# EAGLE design WIK.pl_DC (EAGLE 6.5.0)
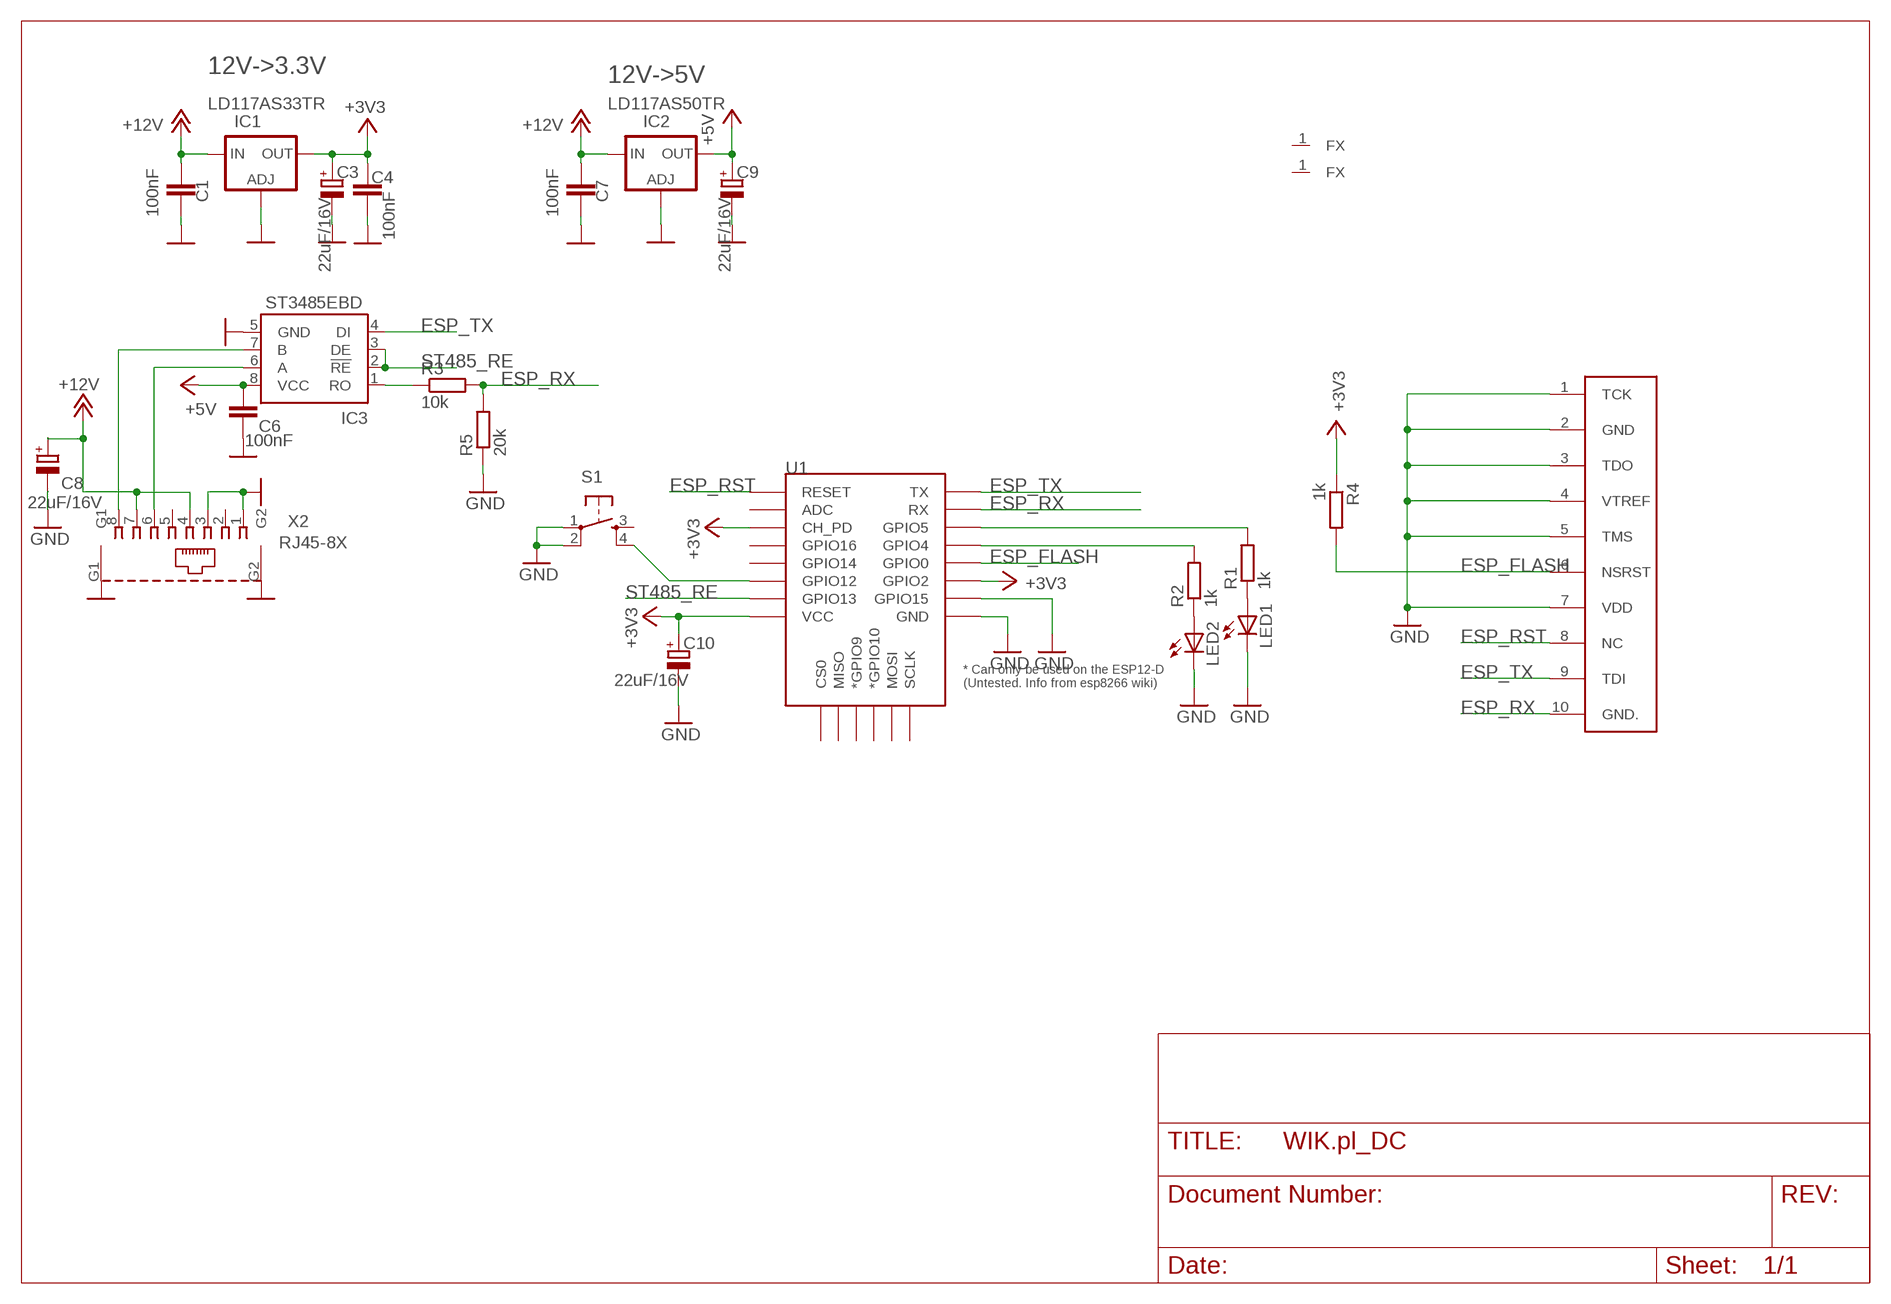
[diagram p0: schematic, sheet 1]

## Parts
C1  100nF  C-EUC0805  [C0805]
C3  22uF/16V  CPOL-EUSMCB  [SMC_B]
C4  100nF  C-EUC0805  [C0805]
C6  100nF  C-EUC0805  [C0805]
C7  100nF  C-EUC0805  [C0805]
C8  22uF/16V  CPOL-EUSMCB  [SMC_B]
C9  22uF/16V  CPOL-EUSMCB  [SMC_B]
C10  22uF/16V  CPOL-EUSMCB  [SMC_B]
IC1  LD117AS33TR  [SOT223]
IC2  LD117AS50TR  [SOT223]
IC3  ST3485EBD  LTC485S  [SOIC8]
LED1  LED1206  [LED-1206]
LED2  LED1206  [LED-1206]
R1  1k  R-EU_R0805  [R0805]
R2  1k  R-EU_R0805  [R0805]
R3  10k  R-EU_R0805  [R0805]
R4  1k  R-EU_R0805  [R0805]
R5  20k  R-EU_R0805  [R0805]
S1  TAC_SWITCHPTH  [TACTILE-PTH]
U1  ESP12ESMD  [ESP12E-SMD]
U$1  FIDUCIAL  [FIDUCIAL]
U$2  FIDUCIAL  [FIDUCIAL]
U$3  TC2050-IDC-NL  [TC2050-IDC-NL]
X2  RJ45-8X  [RJ45-NO-SHIELD]

## Nets
+3V3: C3.+ C4.1 C10.+ IC1.4(OUT) R4.1 U1.CH_PD U1.GPIO2 U1.VCC
+5V: C6.2 C9.+ IC2.4(OUT) IC3.8(VCC)
+12V: C1.1 C7.1 C8.+ IC1.3(IN) IC2.3(IN) X2.4 X2.7
ESP_FLASH: R4.2 U1.GPIO0 U$3.6(NSRST)
ESP_RST: U1.RESET U$3.8(NC)
ESP_RX: R3.2 R5.2 U1.RXD0(RX) U$3.10(GND.)
ESP_TX: IC3.4(DI) U1.TXD0(TX) U$3.9(TDI)
GND: C1.2 C3.- C4.2 C6.1 C7.2 C8.- C9.- C10.- IC1.1(ADJ) IC2.1(ADJ) IC3.5(GND) LED1.C LED2.C R5.1 S1.1 S1.2 U1.GND U1.GPIO15 U$3.1(TCK) U$3.2(GND) U$3.3(TDO) U$3.4(VTREF) U$3.5(TMS) U$3.7(VDD) X2.1 X2.3 X2.G1 X2.G2
N$1: IC3.7(B) X2.8
N$2: R1.2 U1.GPIO5
N$3: IC3.6(A) X2.6
N$4: LED1.A R1.1
N$5: LED2.A R2.1
N$6: R2.2 U1.GPIO4
N$7: S1.4 U1.GPIO12
N$8: IC3.1(RO) R3.1
ST485_RE: IC3.2(!RE) IC3.3(DE) U1.GPIO13
Unconnected: S1.3 U1.ADC U1.CS0 U1.GPIO9(*GPIO9) U1.GPIO10(*GPIO10) U1.GPIO14 U1.GPIO16 U1.MISO U1.MOSI U1.SCLK U$1.1(FX) U$2.1(FX) X2.2 X2.5

## Notes on the sheet
- 12V->3.3V
- 12V->5V

## Library data of the parts
C1 C4 C6 C7 = rcl:C-EU: CAPACITOR, European symbol
C3 C8-C10 = rcl:CPOL-EU: POLARIZED CAPACITOR, European symbol
IC1 IC2 = v-reg:LD117A?*: Low drop fixed and adjustable positive voltage regulators 1 A Source: http://www.st.com/stonline/products/literature/ds/7194/ld1117axx.pdf
IC3 = linear-technology:LTC485: Low Power RS485 Interface Transceiver Source: http://www.linear.com/pc/downloadDocument.do?navId=H0,C1,C1007,C1017,P2064,D1718; OC_FARNELL: unknown; OC_NEWARK: unknown
LED1 LED2 = SparkFun:LED: LEDs Standard schematic elements and footprints for 5mm, 3mm, 1206, and 0603 sized LEDs. 5mm - Spark Fun Electronics SKU : COM-00529 (and others)
R1-R5 = resistor:R-EU_: RESISTOR, European symbol
S1 = SparkFun:TAC_SWITCH: Momentary Switch Button commonly used for reset or general input. Spark Fun Electronics SKU : COM-00097
U1 = esp8266modules:ESP12E: ESP12E Module
U$1 U$2 = testpad:FIDUCIAL: fiducial
U$3 = TC2050-IDC-NL:TC2050-IDC-NL
X2 = con-tycoelectronics:RJ45: CORCOM Modular RJ Jacks No Shield Source: www.tycoelectronics.com .. ENG_DS_1654001_1099_RJ_L_0507.pdf; MPN: RJ45-8X; OC_FARNELL: unknown; OC_NEWARK: 16R6101

## Board
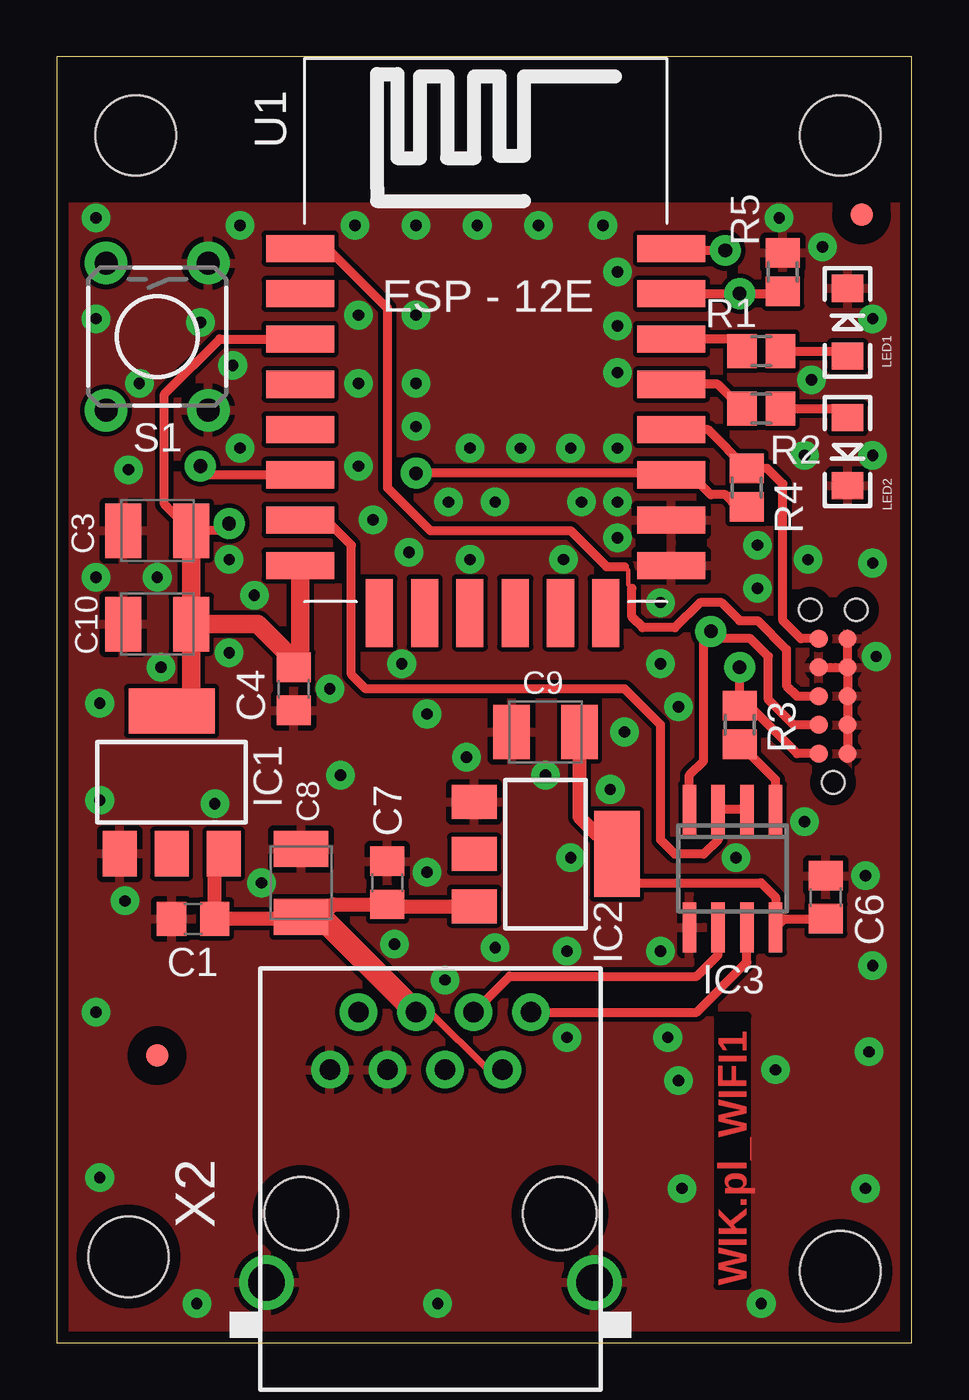
[diagram p1: board, top side]
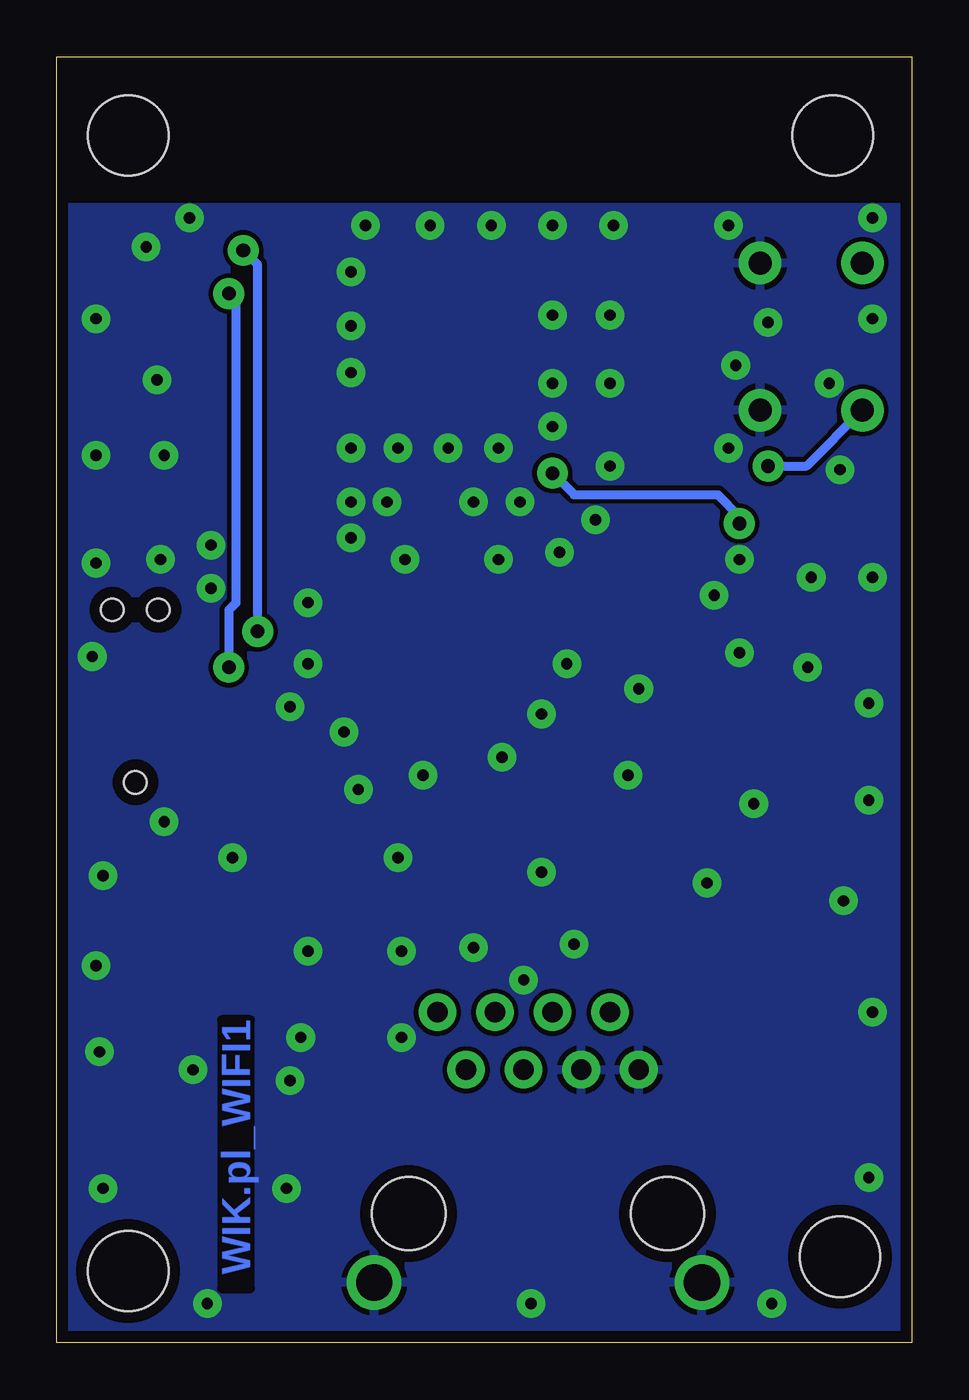
[diagram p2: board, bottom side, seen from below]

Size 37.77 x 56.82 mm. Coordinates in mm from the lower left corner, seen from the top.
Outline: 0,0 37.77,0 37.77,56.82 0,56.82 0,0
Copper layers (1*16): Top 0.035mm / dielectric 1.5mm / Bottom 0.035mm
Design rules "default *": minimum track width 10mil, minimum drill 19mil, track to track 8mil, track to pad 8mil, pad to pad 8mil, via to via 8mil, smd to smd 8mil, copper to edge 20mil, drill to drill 10mil, minimum pad ring 15mil, minimum via ring 15mil, stop-mask expansion 4mil, vias tented up to drill 32mil, thermal gap 10mil
Holes 3.56 mm at 3.17,3.81 34.61,53.34 3.49,53.34 34.61,3.17

### Footprints (pad centres in the part's own frame; a part is rotated, then mirrored left to right if it is on the bottom)
C0805 = smd 1.3 x 1.5: 1 -0.95,0; 2 0.95,0
SMC_B = smd 1.6 x 2.4: + -1.5,0; - 1.5,0
SOT223 = smd 1.5 x 2: 1 -2.3,-3.15; 2 0,-3.15; 3 2.3,-3.15 | smd 3.8 x 2: 4 0,3.15
SOIC8 = smd 0.6 x 2.2: 1 -1.905,-2.6; 2 -0.635,-2.6; 3 0.635,-2.6; 4 1.905,-2.6; 5 1.905,2.6; 6 0.635,2.6; 7 -0.635,2.6; 8 -1.905,2.6
LED-1206 = smd 1.2 x 1.4: A -1.5,0; C 1.5,0
R0805 = smd 1.3 x 1.5: 1 -0.85,0; 2 0.85,0
TACTILE-PTH = drill 1.016 pad 1.88: 1 -3.251,2.261; 2 3.251,2.261; 3 -3.251,-2.261; 4 3.251,-2.261
ESP12E-SMD = smd 3 x 1.2: ADC -8.3,3.8; CH_PD -8.3,1.8; GND 8.1,-8.2; GPIO0 8.1,-2.2; GPIO2 8.1,-4.2; GPIO4 8.1,-0.2; GPIO5 8.1,1.8; GPIO12 -8.3,-4.2; GPIO13 -8.3,-6.2; GPIO14 -8.3,-2.2; GPIO15 8.1,-6.2; GPIO16 -8.3,-0.2; RESET -8.3,5.8; RXD0 8.1,3.8; TXD0 8.1,5.8; VCC -8.3,-8.2 | smd 1.2 x 3: CS0 -4.8,-10.3; GPIO9 -0.8,-10.3; GPIO10 1.2,-10.3; MISO -2.8,-10.3; MOSI 3.2,-10.3; SCLK 5.2,-10.3
FIDUCIAL = smd 1 x 1: 1 0,0
TC2050-IDC-NL = smd 0.787 x 0.787: 1 -2.54,-1.27; 2 -1.27,-1.27; 3 0,-1.27; 4 1.27,-1.27; 5 2.54,-1.27; 6 2.54,0; 7 1.27,0; 8 0,0; 9 -1.27,0; 10 -2.54,0 | hole 1: -3.81,-0.635; 3.81,0.381; 3.81,-1.651
RJ45-NO-SHIELD = drill 0.9 pad 1.4: 1 -4.445,6.35; 2 -3.175,8.89; 3 -1.905,6.35; 4 -0.635,8.89; 5 0.635,6.35; 6 1.905,8.89; 7 3.175,6.35; 8 4.445,8.89 | drill 1.6: G1 -7.239,-3.048; G2 7.239,-3.048 | hole 3.251: -5.715,0; 5.715,0

### Placement (x,y rotation side)
C1  6.03,18.73 180 top
C3  4.45,35.88 180 top
C4  10.48,28.89 270 top
C6  33.97,19.68 270 top
C7  14.61,20.32 90 top
C8  10.79,20.32 90 top
C9  21.59,26.99 180 top
C10  4.45,31.75 180 top
IC1  5.08,24.77 0 top
IC2  21.59,21.59 270 top
IC3  29.84,20.95 180 top
LED1  34.92,45.09 90 top
LED2  34.92,39.37 270 top
R1  31.11,43.81 180 top
R2  31.11,41.27 180 top
R3  30.16,27.3 90 top
R4  30.48,37.78 90 top
R5  32.07,47.31 270 top
S1  4.45,44.45 270 top
U1  19.05,42.55 0 top
U$1  4.45,12.7 0 top
U$2  35.56,49.85 0 top
U$3  33.66,28.57 90 top
X2  16.51,5.71 0 top

### Tracks (layer width: path | path; a pad name or v marks a point on that pad's centre or on a via)
+3V3  (via drill 0.6)
  Top 0.406: R4.1 30.06,36.93 29.53,37.47 28.89,37.47 27.94,38.42 27.22,38.42 U1.GPIO2 27.08,38.42 v15.88,38.42 | U1.CH_PD 7.2,44.34 4.76,41.91 4.76,37.06 C3.+ 7.3,35.88 v7.62,36.2
  Top 0.813: IC1.4 5.95,28.78 C10.+ | C10.+ C3.+ | C4.1 10.47,30.16 | C10.+ 8.89,31.75 10.47,30.16 | 10.47,30.16 10.48,30.16 10.75,30.43 U1.VCC
  Bottom 0.406: v15.88,38.42 14.92,37.47 8.57,37.47 7.62,36.51 v7.62,36.2
+5V
  Top 0.406: C6.2 32.13,18.73 IC3.8 31.75,19.68 31.11,20.32 24.74,20.32 IC2.4
  Top 0.61: C9.+ 23.09,23.24 IC2.4
+12V
  Top 0.305: X2.7 19.05,12.06 16.51,14.61 X2.4
  Top 0.61: C8.+ 10.71,18.73 C1.1 6.98,21.22 IC1.3 | 11.66,18.82 12.21,19.37 C7.1 14.69,19.29 IC2.3
  Top 1.016: C8.+ 11.66,18.82 X2.4
ESP_FLASH
  Top 0.406: U1.GPIO0 28.77,40.34 R4.2 31.38,38.63 32.07,37.94 32.07,31.91 32.86,31.11 U$3.6
ESP_RST
  Top 0.203: 25.08,34.29 25.24,34.13 25.24,33.5 25.4,33.34
  Top 0.406: U1.RESET 11.98,48.34 14.61,45.72 14.61,37.78 16.51,35.88 22.7,35.88 24.29,34.29 25.08,34.29 | U$3.8 32.7,28.57 32.23,29.05 32.23,30.64 30.96,31.91 30.16,31.91 29.37,32.7 28.42,32.7 27.3,31.59 25.88,31.59 25.4,32.07 25.4,33.34
ESP_RX  (via drill 0.6)
  Top 0.406: 27.16,46.35 U1.RXD0 v30.15,46.34 v30.16,46.35 31.96,46.35 R5.2 | v30.16,29.84 R3.2 30.38,27.94 30.8,27.94 32.7,26.04 U$3.10
  Bottom 0.406: v30.16,46.35 29.84,46.04 29.84,32.7 30.16,32.38 v30.16,29.84
ESP_TX  (via drill 0.6)
  Top 0.406: IC3.4 27.94,25.08 28.57,25.72 28.57,31.11 v28.89,31.43 29.21,31.11 30.64,31.11 31.43,30.32 31.43,28.42 32.54,27.3 U$3.9 | v29.53,48.26 27.38,48.26 U1.TXD0
  Bottom 0.406: v28.89,31.43 28.89,47.62 v29.53,48.26
GND  (via drill 0.5)
  Top 0.406: U$3.7 U$3.4 | U$3.4 U$3.5 | U$3.4 U$3.3 U$3.2 U$3.1
  other vias: 26.67,32.7 25.08,26.99 26.67,30 24.77,35.56 24.77,37.15 17.3,37.15 22.38,34.61 18.26,34.61 13.97,36.35 13.34,38.73 13.34,45.4 15.88,42.39 13.34,42.39 15.88,40.48 15.88,45.4 13.18,49.37 8.1,49.37 15.88,49.37 18.57,49.37 21.27,49.37 24.13,49.37 31.91,49.69 33.81,48.42 36.04,45.24 36.04,39.21 33.02,39.21 30.96,35.24 30.96,33.34 36.2,30.32 27.46,28.1 30,21.43 33.02,23.02 35.72,20.64 35.72,6.83 31.11,1.75 27.62,6.83 31.75,12.06 27.46,11.59 22.54,13.49 26.99,13.49 26.67,17.3 22.54,17.3 17.14,16.03 14.92,17.62 19.37,17.46 22.7,21.43 24.45,24.45 18.1,25.88 21.59,25.08 16.35,20.8 9.05,20.32 12.06,28.89 15.24,30 7.62,30.48 4.6,29.84 4.45,33.81 3.17,38.58 3.65,42.39 7.78,43.18 6.35,45.09 1.75,49.69 1.75,33.81 1.91,28.26 1.91,23.97 6.99,23.81 3.02,19.53 6.19,1.75 1.91,7.3 1.75,14.61 16.83,1.75 35.88,12.86 36.04,16.67 16.35,27.78 8.1,39.53 24.77,47.31 24.77,44.93 24.77,42.86 24.77,39.53 22.7,39.53 20.48,39.53 18.26,39.53 19.37,37.15 23.18,37.15 15.56,34.92 36.04,34.45 33.18,34.61 12.54,25.08 1.75,45.24 33.34,42.55 8.73,33.02 7.62,34.61
  pour Top: 0,0 37.78,0 37.78,50.16 0,50.16
  pour Bottom: 0,0 37.78,0 37.78,50.16 0,50.16
N$1
  Top 0.406: X2.8 28.26,14.61 30.48,16.83 IC3.7
N$2
  Top 0.406: R1.2 29.73,44.34 U1.GPIO5
N$3
  Top 0.406: X2.6 20,16.19 28.26,16.19 29.21,17.14 IC3.6
N$4
  Top 0.406: R1.1 34.7,43.81 LED1.A
N$5
  Top 0.406: R2.1 34.52,41.27 LED2.A
N$6
  Top 0.406: R2.2 29.2,42.34 U1.GPIO4
N$7  (via drill 0.6)
  Top 0.406: U1.GPIO12 6.74,38.34 v6.35,38.73
  Bottom 0.406: v6.35,38.73 4.65,38.73 S1.4
N$8
  Top 0.406: IC3.1 31.75,24.87 R3.1
ST485_RE
  Top 0.406: IC3.2 IC3.3 29.21,22.23 28.57,21.59 27.3,21.59 26.67,22.23 26.67,27.3 25.08,28.89 13.65,28.89 13.02,29.53 13.02,35.24 12.06,36.2 10.9,36.2 U1.GPIO13

### Text on the board
Top: WIK.pl_WIFI1
Bottom: WIK.pl_WIFI1